# Altium schematic sheet 背景抑制经济款电子元器件示意图 - 20260117完整版.SchDoc
size A2
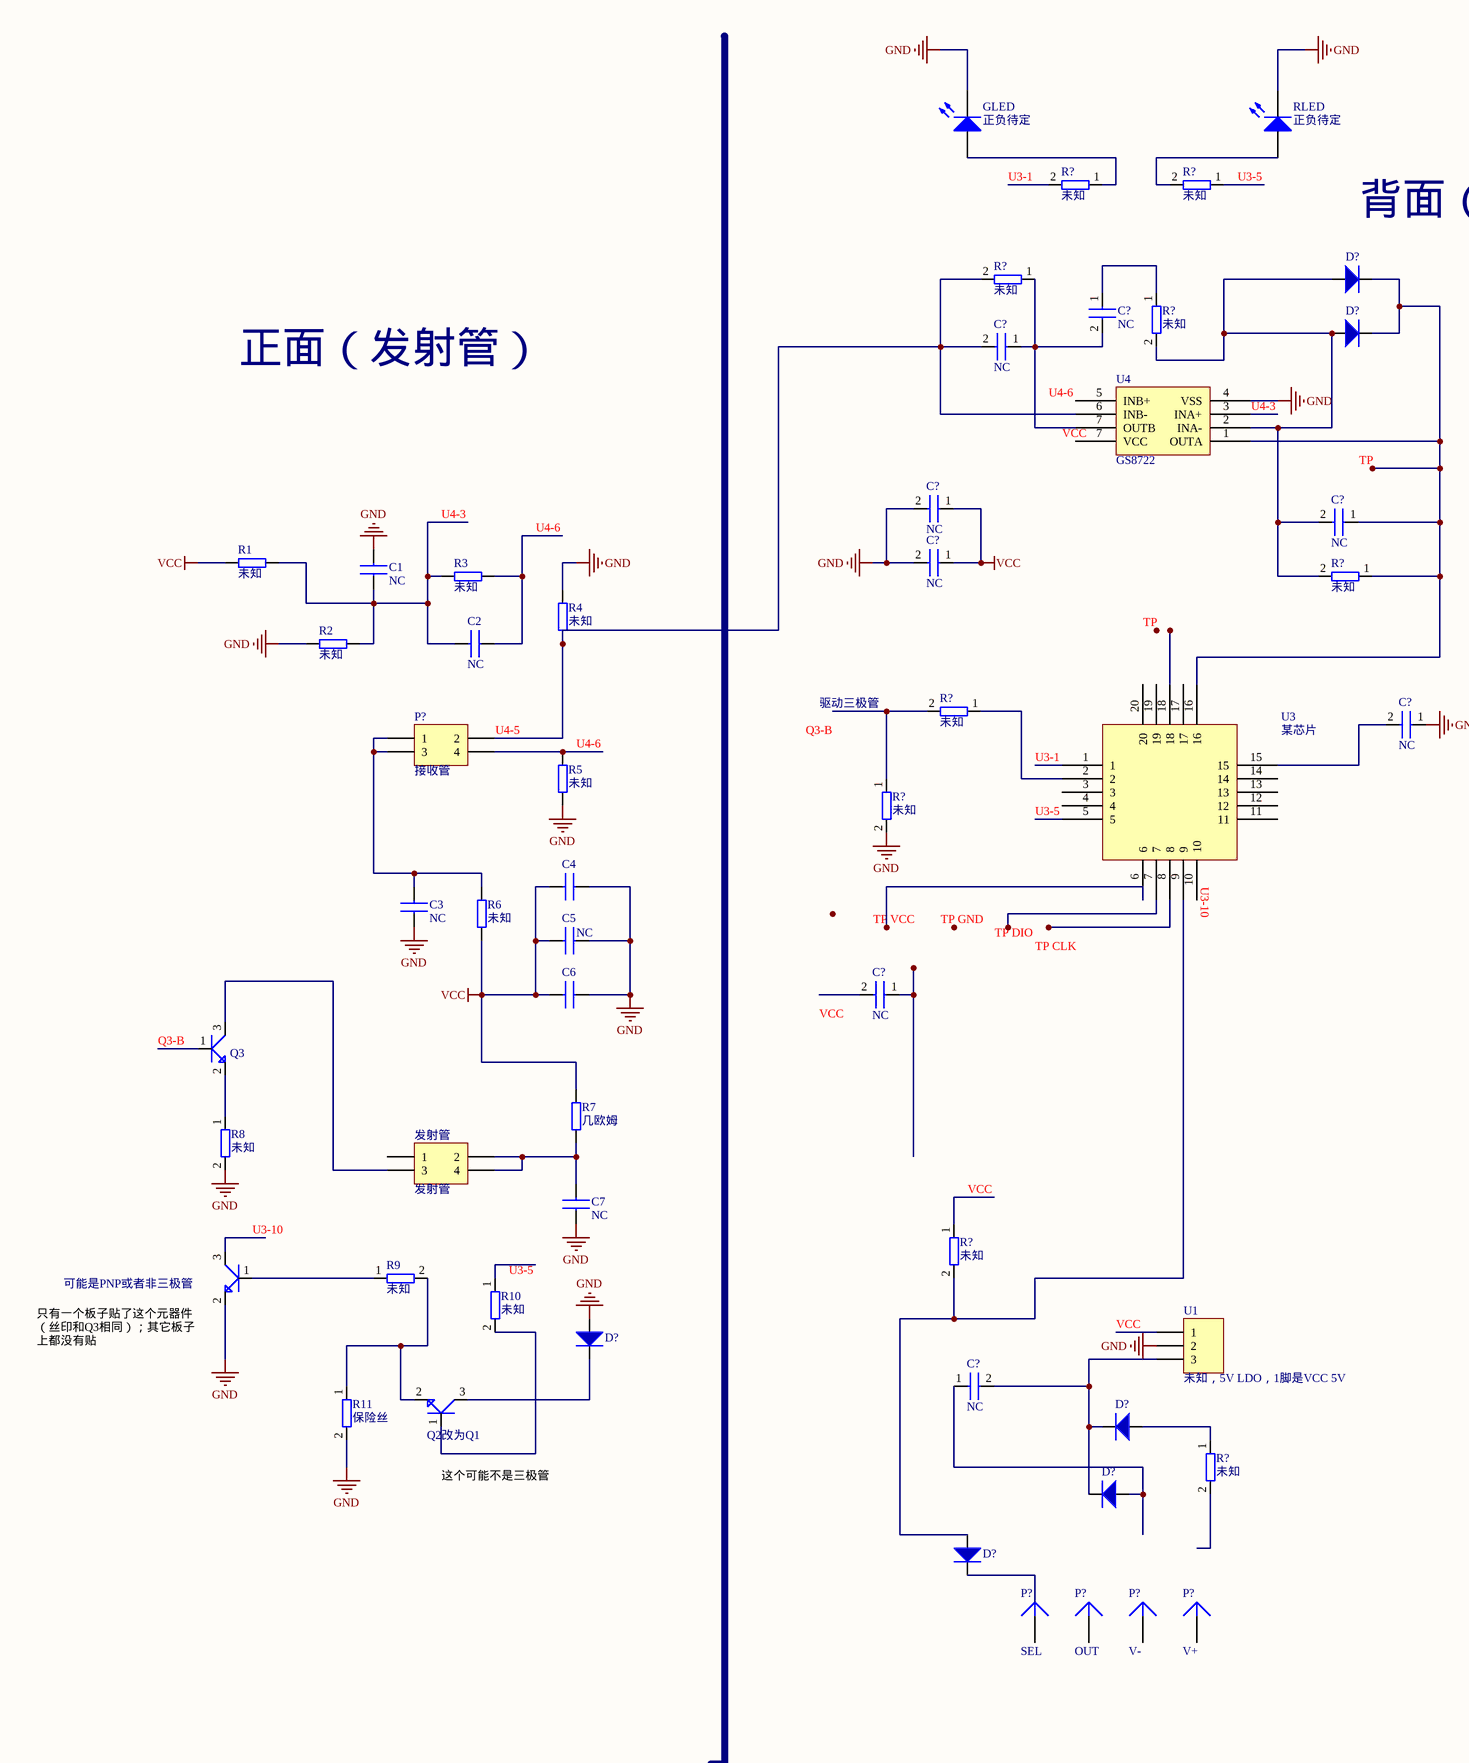
[diagram p0: 背景抑制经济款电子元器件示意图 - 20260117完整版.SchDoc, left]
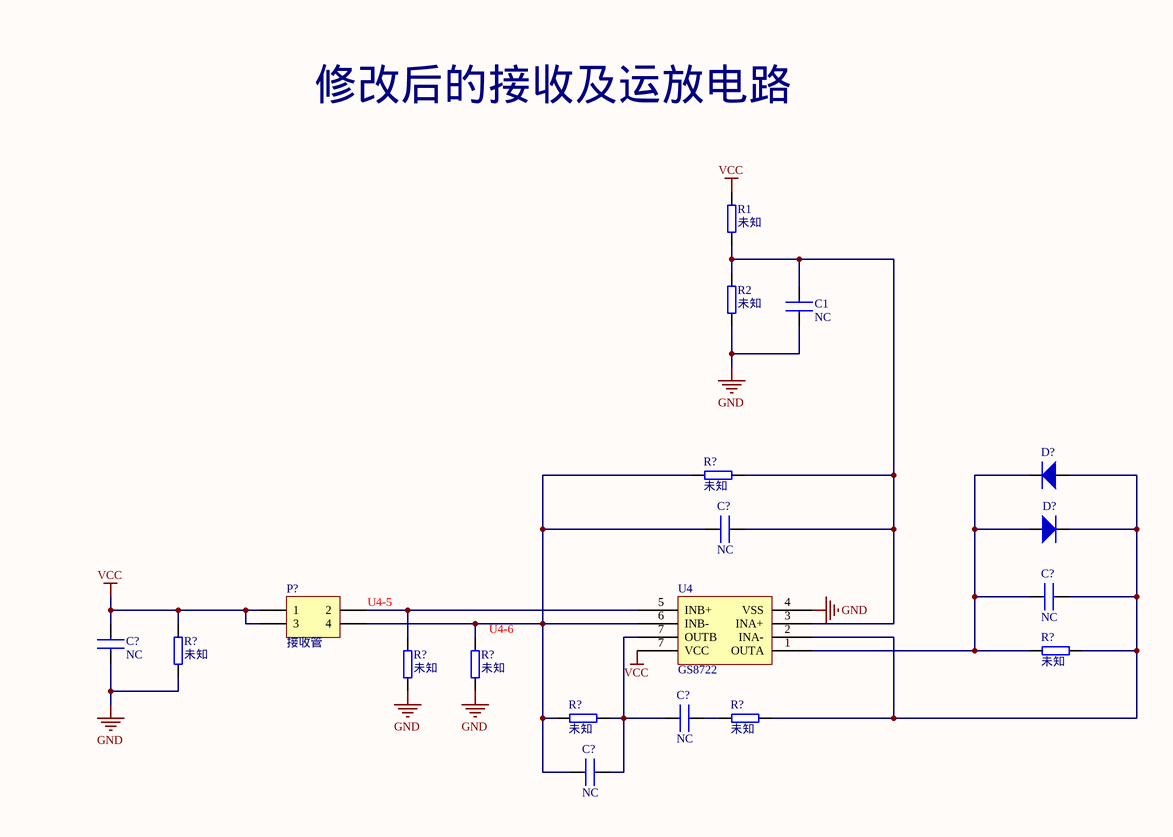
[diagram p1: 背景抑制经济款电子元器件示意图 - 20260117完整版.SchDoc, right]

## Parts
(Parts that share a designator on the sheet are numbered #1, #2 ... from top to bottom, then left to right.)
C1#1  NC
C1#2  NC
C2  NC
C3  NC
C4  NC  (value not drawn)
C5  NC
C6  NC  (value not drawn)
C7  NC
C?#1  NC
C?#2  NC
C?#3  NC
C?#4  NC
C?#5  NC
C?#6  NC
C?#7  NC
C?#8  NC
C?#9  NC
C?#10  NC
C?#11  NC
C?#12  NC
C?#13  NC
D?#1  (no value)
D?#2  (no value)
D?#3  (no value)
D?#4  (no value)
D?#5  (no value)
D?#6  (no value)
D?#7  (no value)
D?#8  (no value)
GLED  正负待定  [LED-0]
P?#1  接收管  [HDR2X2]
P?#2  接收管  [HDR2X2]
P?#3  SEL  [PIN1]
P?#4  OUT  [PIN1]
P?#5  V-  [PIN1]
P?#6  V+  [PIN1]
Q2改为Q1  2SC4617TLR  (value not drawn)
Q3  2SC4617TLR  (value not drawn)
R1#1  未知
R1#2  未知
R2#1  未知
R2#2  未知
R3  未知
R4  未知
R5  未知
R6  未知
R7  几欧姆
R8  未知
R9  未知
R10  未知
R11  保险丝
R?#1  未知
R?#2  未知
R?#3  未知
R?#4  未知
R?#5  未知
R?#6  未知
R?#7  未知
R?#8  未知
R?#9  未知
R?#10  未知
R?#11  未知
R?#12  未知
R?#13  未知
R?#14  未知
R?#15  未知
R?#16  未知
RLED  正负待定  [LED-0]
U1  未知，5V LDO，1脚是VCC 5V  [HDR1X3]
U3  某芯片
U4#1  GS8722
U4#2  GS8722
发射管  发射管  [HDR2X2]
可能是PNP或者非三极管  2SC4617TLR  (value not drawn)

## Nets
GND: C1#1.1 C1#2.2 C3.2 C4.2 C5.2 C6.2 C7.1 C?#3.2 C?#5.2 C?#6.1 C?#11.2 D?#3.1 GLED.2(K) R2#1.2 R2#2.1 R4.1 R5.1 R8.2 R11.2 R?#7.2 R?#11.2 R?#13.1 R?#14.1 RLED.2(K) U1.2 U4#1.4(VSS) U4#2.4(VSS) 可能是PNP或者非三极管.2(E)
VCC: C4.1 C5.1 C6.1 C?#3.1 C?#5.1 C?#11.1 P?#2.1 P?#2.3 R1#1.2 R1#2.1 R6.2 R7.1 R?#11.1 U4#2.7(VCC)
NetC1#1_2: C1#1.2 C2.2 R1#1.1 R2#1.1 R3.2
NetC1#2_1: C1#2.1 C?#9.1 R1#2.2 R2#2.2 R?#10.1 U4#2.3(INA+)
NetC2_1: C2.1 R3.1
NetC3_1: C3.1 P?#1.1 P?#1.3 R6.1
NetC7_2: C7.2 R7.2 发射管.2 发射管.4
NetC?#1_1: C?#1.1 R?#4.1
NetC?#1_2: C?#1.2 C?#2.1 R?#3.1 U4#1.7(OUTB)
NetC?#2_2: C?#2.2 P?#1.2 R4.2 R?#3.2 U4#1.6(INB-)
NetC?#4_1: C?#4.1 D?#1.2 D?#2.2 R?#5.1 U3.16 U4#1.1(OUTA)
NetC?#4_2: C?#4.2 D?#1.1 D?#2.1 R?#4.2 R?#5.2 U4#1.2(INA-)
NetC?#6_2: C?#6.2 U3.15
NetC?#8_1: C?#8.1 D?#6.1
NetC?#8_2: C?#8.2 D?#4.2 D?#6.2 U1.3
NetC?#9_2: C?#9.2 C?#13.2 P?#2.4 R?#10.2 R?#14.2 R?#15.2 U4#2.6(INB-)
NetC?#10_1: C?#10.1 D?#5.1 D?#7.2 R?#12.1 R?#16.2 U4#2.2(INA-)
NetC?#10_2: C?#10.2 D?#5.2 D?#7.1 R?#12.2 U4#2.1(OUTA)
NetC?#12_1: C?#12.1 R?#16.1
NetC?#12_2: C?#12.2 C?#13.1 R?#15.1 U4#2.7(OUTB)
NetD?#3_2: D?#3.2 Q2改为Q1.3(C)
NetD?#4_1: D?#4.1 R?#9.1
NetD?#8_1: D?#8.1 R?#8.2 U3.9
NetGLED_1: GLED.1(A) R?#1.1
NetP?#1_4: P?#1.4 R5.2
NetP?#2_2: P?#2.2 R?#13.2 U4#2.5(INB+)
NetQ2改为Q1_1: Q2改为Q1.1(B) R10.2
NetQ2改为Q1_2: Q2改为Q1.2(E) R9.2 R11.1
NetQ3_2: Q3.2(E) R8.1
NetQ3_3: Q3.3(C) 发射管.3
NetR9_1: R9.1 可能是PNP或者非三极管.1(B)
NetR?#2_2: R?#2.2 RLED.1(A)
NetR?#6_1: R?#6.1 U3.2
NetR?#6_2: R?#6.2 R?#7.1

Not connected (* = marked no-connect by the designer): C?#7 1 2; D?#8 2; P?#3 1; P?#4 1; P?#5 1; P?#6 1; Q3 1(B); R10 1; R?#1 2; R?#2 1; R?#8 1; R?#9 2; U1 1; U3 1 3 4 5 6 7 8 10 11 12 13 14 17 18 19 20; U4#1 3(INA+) 5(INB+); 发射管 1; 可能是PNP或者非三极管 3(C)

## Notes on the sheet
- (near R?#1) U3-1
- U3-5
- 背面（芯片）
- 正面（发射管）
- U4-6
- (near U4#1) VCC
- (near U4#1) U4-3
- TP
- U4-3
- 驱动三极管
- (near P?#1) U4-5
- (near R5) U4-6
- Q3-B
- (near U3) U3-1
- (near U3) U3-5
- (near U3) U3-10
- TP VCC
- TP GND
- TP DIO
- TP CLK
- (near Q3) Q3-B
- (near C?#7) VCC
- 修改后的接收及运放电路
- (near 可能是PNP或者非三极管) U3-10
- (near R?#8) VCC
- (near R10) U3-5
- (near U1) VCC
- (near 可能是PNP或者非三极管) 只有一个板子贴了这个元器件（丝印和Q3相同）；其它板子上都没有贴
- 这个可能不是三极管
- U4-5
- (near R?#14) U4-6

## Library data of the parts
C1#1 C1#2 C2-C7 C?#1-C?#13 = CAP
D?#1-D?#8 = D
GLED RLED = LED0: Typical INFRARED GaAs LED; Published: 8-Jun-2000; LatestRevisionDate: 08-Jul-2005; LatestRevisionNote: Mech Layer 1 removed.; PackageReference: LED-0; Publisher: Altium Limited; PackageDescription: LED; 2 Leads
P?#1 P?#2 发射管 = Header 2X2: Header, 2-Pin, Dual row; LatestRevisionDate: 17-Jul-2002; LatestRevisionNote: Re-released for DXP Platform.; Publisher: Altium Limited
P?#3-P?#6 = Plug: LatestRevisionDate: 17-Jul-2002; LatestRevisionNote: Re-released for DXP Platform.; Publisher: Altium Limited
Q2改为Q1 Q3 可能是PNP或者非三极管 = 2SC4617
R1#1 R1#2 R2#1 R2#2 R3-R11 R?#1-R?#16 = RES
U1 = Header 3: Header, 3-Pin; LatestRevisionDate: 17-Jul-2002; LatestRevisionNote: Re-released for DXP Platform.; Publisher: Altium Limited
U4#1 U4#2 = GS358